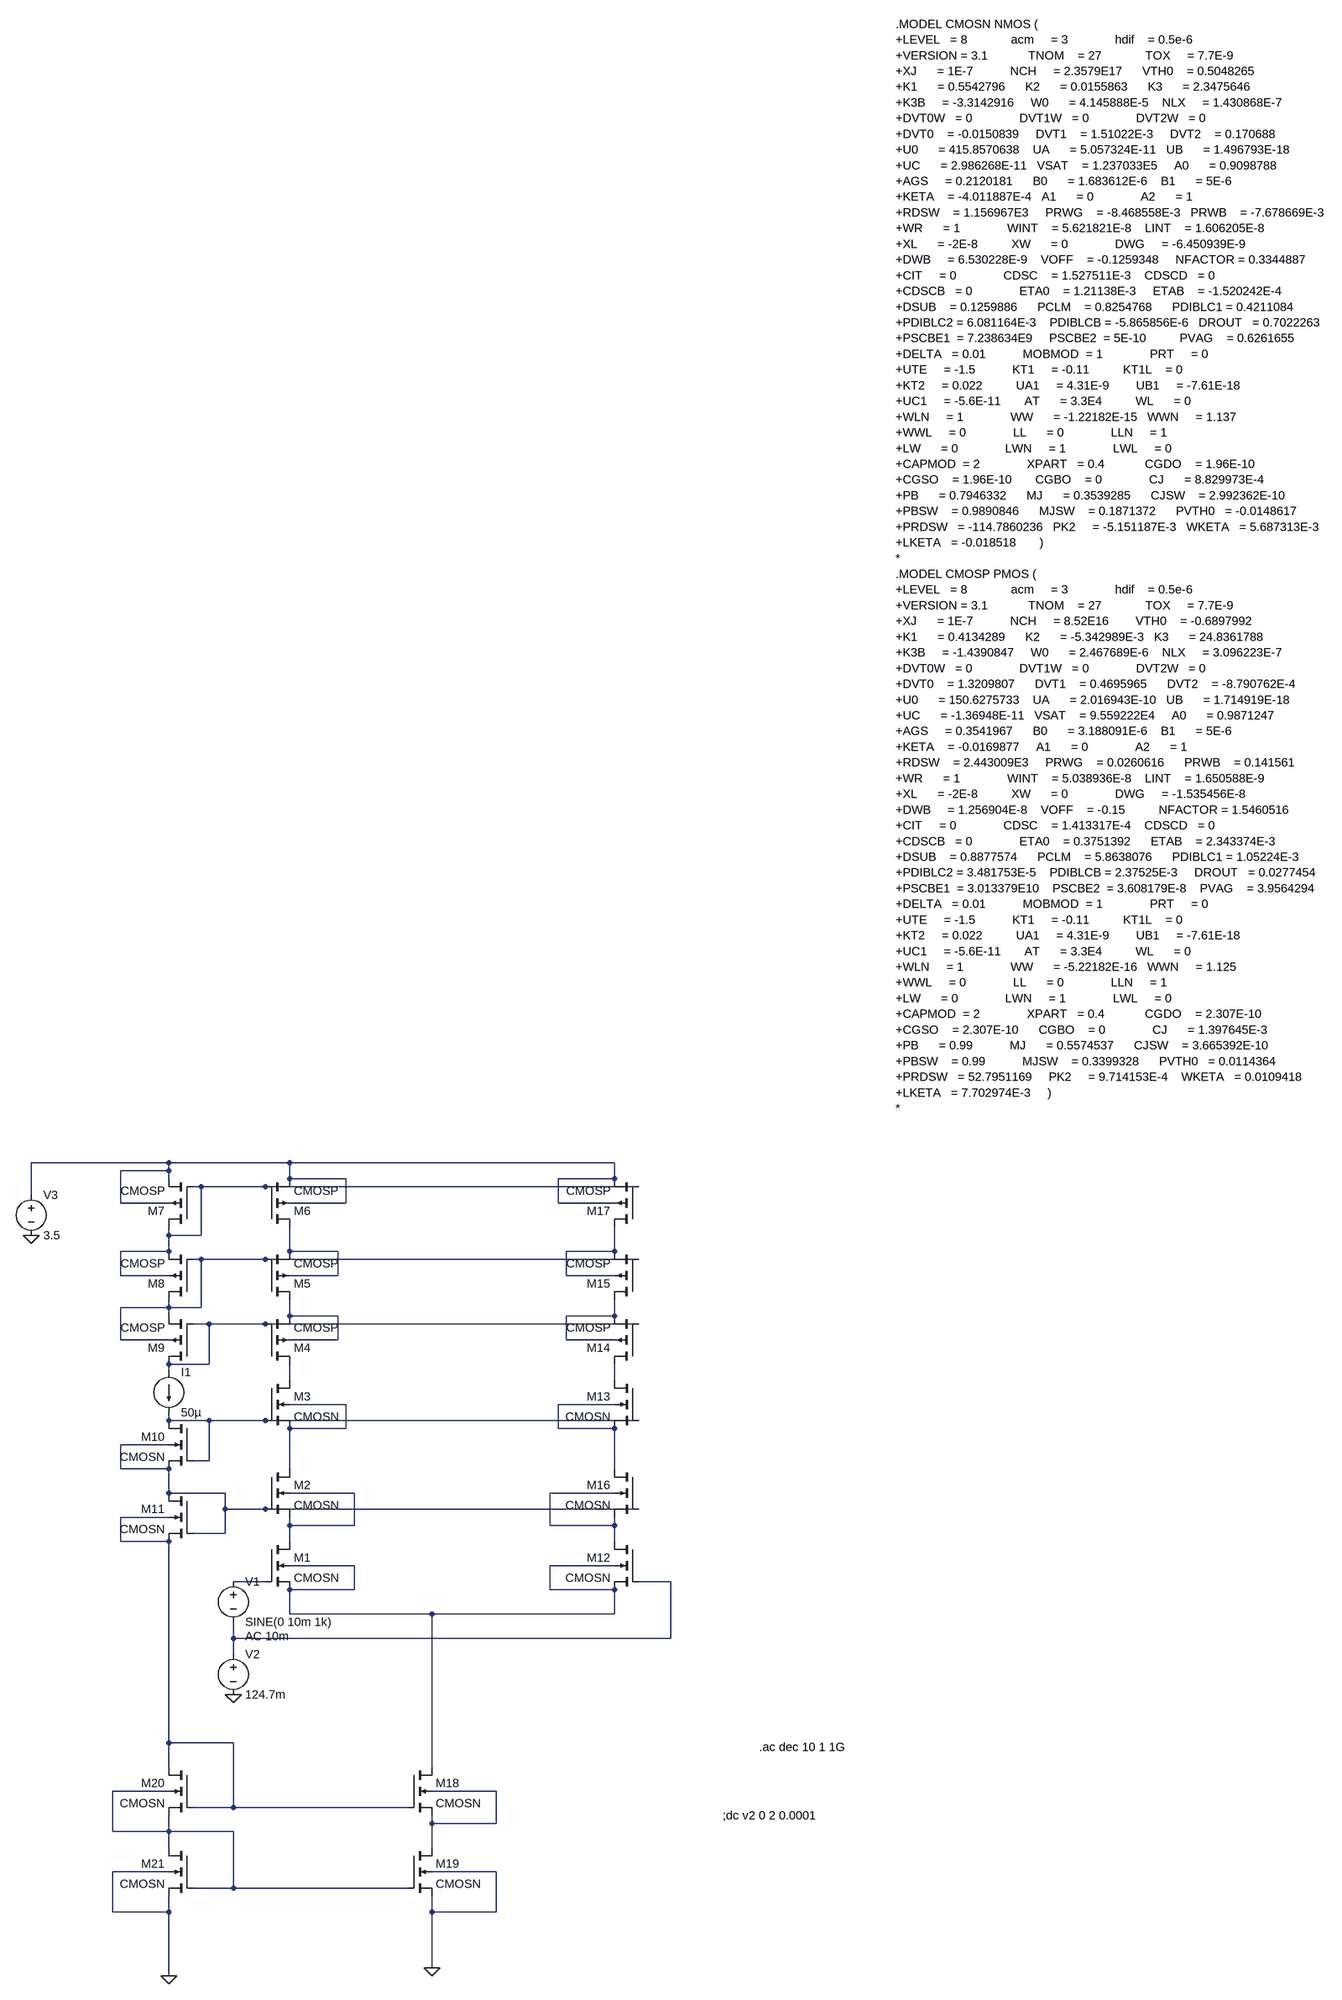
[diagram p0: schematic 92db.asc]
92db.asc, the LTspice schematic file:
Version 4
SHEET 1 3620 1788
WIRE -176 -496 -576 -496
WIRE 64 -496 -176 -496
WIRE 1024 -496 64 -496
WIRE -176 -480 -176 -496
WIRE -176 -480 -272 -480
WIRE -176 -464 -176 -480
WIRE 64 -464 64 -496
WIRE 176 -464 64 -464
WIRE 1024 -464 1024 -496
WIRE 1024 -464 912 -464
WIRE -112 -448 -128 -448
WIRE 16 -448 -112 -448
WIRE 1072 -448 16 -448
WIRE -576 -432 -576 -496
WIRE -272 -416 -272 -480
WIRE -176 -416 -272 -416
WIRE 176 -416 176 -464
WIRE 176 -416 64 -416
WIRE 912 -416 912 -464
WIRE 1024 -416 912 -416
WIRE -176 -352 -176 -368
WIRE -112 -352 -112 -448
WIRE -112 -352 -176 -352
WIRE -176 -320 -176 -352
WIRE -176 -320 -272 -320
WIRE 64 -320 64 -368
WIRE 160 -320 64 -320
WIRE 1024 -320 1024 -368
WIRE 1024 -320 928 -320
WIRE -112 -304 -128 -304
WIRE 16 -304 -112 -304
WIRE 1072 -304 16 -304
WIRE -272 -272 -272 -320
WIRE -176 -272 -272 -272
WIRE 160 -272 160 -320
WIRE 160 -272 64 -272
WIRE 928 -272 928 -320
WIRE 1024 -272 928 -272
WIRE -176 -208 -176 -224
WIRE -176 -208 -272 -208
WIRE -112 -208 -112 -304
WIRE -112 -208 -176 -208
WIRE -176 -192 -176 -208
WIRE 64 -192 64 -224
WIRE 160 -192 64 -192
WIRE 1024 -192 1024 -224
WIRE 1024 -192 928 -192
WIRE -96 -176 -128 -176
WIRE 16 -176 -96 -176
WIRE 1072 -176 16 -176
WIRE -272 -144 -272 -208
WIRE -176 -144 -272 -144
WIRE 160 -144 160 -192
WIRE 160 -144 64 -144
WIRE 928 -144 928 -192
WIRE 1024 -144 928 -144
WIRE -96 -96 -96 -176
WIRE -96 -96 -176 -96
WIRE -176 -80 -176 -96
WIRE 64 -64 64 -96
WIRE 1024 -64 1024 -96
WIRE 176 -16 64 -16
WIRE 1024 -16 912 -16
WIRE -176 16 -176 0
WIRE -96 16 -176 16
WIRE 16 16 -96 16
WIRE 1072 16 16 16
WIRE 176 32 176 -16
WIRE 176 32 64 32
WIRE 912 32 912 -16
WIRE 1024 32 912 32
WIRE -176 64 -272 64
WIRE -96 96 -96 16
WIRE -96 96 -128 96
WIRE -272 112 -272 64
WIRE -176 112 -272 112
WIRE 64 112 64 32
WIRE 1024 112 1024 32
WIRE -176 160 -176 112
WIRE -64 160 -176 160
WIRE 192 160 64 160
WIRE 1024 160 896 160
WIRE -64 192 -64 160
WIRE 16 192 -64 192
WIRE 1072 192 16 192
WIRE -176 208 -272 208
WIRE 64 224 64 208
WIRE 192 224 192 160
WIRE 192 224 64 224
WIRE 896 224 896 160
WIRE 1024 224 1024 208
WIRE 1024 224 896 224
WIRE -64 240 -64 192
WIRE -64 240 -128 240
WIRE -272 256 -272 208
WIRE -176 256 -272 256
WIRE 64 256 64 224
WIRE 1024 256 1024 224
WIRE 192 304 64 304
WIRE 1024 304 896 304
WIRE 16 336 -48 336
WIRE 1136 336 1072 336
WIRE 192 352 192 304
WIRE 192 352 64 352
WIRE 896 352 896 304
WIRE 1024 352 896 352
WIRE 64 400 64 352
WIRE 528 400 64 400
WIRE 1024 400 1024 352
WIRE 1024 400 528 400
WIRE -48 448 -48 416
WIRE 1136 448 1136 336
WIRE 1136 448 -48 448
WIRE -48 480 -48 448
WIRE -176 656 -176 256
WIRE -48 656 -176 656
WIRE -176 704 -176 656
WIRE 528 704 528 400
WIRE -176 752 -288 752
WIRE 656 752 528 752
WIRE -48 784 -48 656
WIRE -48 784 -128 784
WIRE 480 784 -48 784
WIRE 528 816 528 800
WIRE 656 816 656 752
WIRE 656 816 528 816
WIRE -288 832 -288 752
WIRE -176 832 -176 800
WIRE -176 832 -288 832
WIRE -48 832 -176 832
WIRE -176 864 -176 832
WIRE 528 864 528 816
WIRE -176 912 -288 912
WIRE 656 912 528 912
WIRE -48 944 -48 832
WIRE -48 944 -128 944
WIRE 480 944 -48 944
WIRE -288 992 -288 912
WIRE -176 992 -176 960
WIRE -176 992 -288 992
WIRE 528 992 528 960
WIRE 656 992 656 912
WIRE 656 992 528 992
WIRE 528 1104 528 992
WIRE -176 1120 -176 992
FLAG -48 560 0
FLAG -576 -352 0
FLAG -176 1120 0
FLAG 528 1104 0
SYMBOL nmos4 16 256 R0
SYMATTR InstName M1
SYMATTR Value CMOSN
SYMATTR Value2 l=0.8u w=399.0422985u
SYMBOL nmos4 16 -64 R0
SYMATTR InstName M3
SYMATTR Value CMOSN
SYMATTR Value2 l=0.8u w=3.832402235u
SYMBOL pmos4 16 -96 M180
SYMATTR InstName M4
SYMATTR Value CMOSP
SYMATTR Value2 l=0.8u w=0.08726248481u
SYMBOL pmos4 16 -224 M180
SYMATTR InstName M5
SYMATTR Value CMOSP
SYMATTR Value2 l=0.8u w=0.08726248481u
SYMBOL pmos4 -128 -224 R180
SYMATTR InstName M8
SYMATTR Value CMOSP
SYMATTR Value2 l=0.8u w=87.26248481u
SYMBOL pmos4 -128 -96 R180
SYMATTR InstName M9
SYMATTR Value CMOSP
SYMATTR Value2 l=0.8u w=87.26248481u
SYMBOL nmos4 -128 16 M0
SYMATTR InstName M10
SYMATTR Value CMOSN
SYMATTR Value2 l=0.8u w=3832.402235u
SYMBOL current -176 -80 R0
WINDOW 123 0 0 Left 0
WINDOW 39 0 0 Left 0
SYMATTR InstName I1
SYMATTR Value 50µ
SYMBOL voltage -48 320 R0
WINDOW 123 24 124 Left 2
WINDOW 39 0 0 Left 0
SYMATTR Value2 AC 10m
SYMATTR InstName V1
SYMATTR Value SINE(0 10m 1k)
SYMBOL voltage -48 464 R0
WINDOW 123 0 0 Left 0
WINDOW 39 0 0 Left 0
SYMATTR InstName V2
SYMATTR Value 124.7m
SYMBOL voltage -576 -448 R0
WINDOW 123 0 0 Left 0
WINDOW 39 0 0 Left 0
SYMATTR InstName V3
SYMATTR Value 3.5
SYMBOL nmos4 16 112 R0
SYMATTR InstName M2
SYMATTR Value CMOSN
SYMATTR Value2 l=0.8u w=3.832402235u
SYMBOL nmos4 -128 160 M0
SYMATTR InstName M11
SYMATTR Value CMOSN
SYMATTR Value2 l=0.8u w=977.5538809u
SYMBOL pmos4 -128 -368 R180
SYMATTR InstName M7
SYMATTR Value CMOSP
SYMATTR Value2 l=0.8u w=319.4316672u
SYMBOL pmos4 16 -368 M180
SYMATTR InstName M6
SYMATTR Value CMOSP
SYMATTR Value2 l=0.8u w=0.3194316672u
SYMBOL nmos4 1072 256 M0
SYMATTR InstName M12
SYMATTR Value CMOSN
SYMATTR Value2 l=0.8u w=399.0422985u
SYMBOL nmos4 1072 -64 M0
SYMATTR InstName M13
SYMATTR Value CMOSN
SYMATTR Value2 l=0.8u w=3.832402235u
SYMBOL pmos4 1072 -96 R180
SYMATTR InstName M14
SYMATTR Value CMOSP
SYMATTR Value2 l=0.8u w=0.08726248481u
SYMBOL pmos4 1072 -224 R180
SYMATTR InstName M15
SYMATTR Value CMOSP
SYMATTR Value2 l=0.8u w=0.08726248481u
SYMBOL nmos4 1072 112 M0
SYMATTR InstName M16
SYMATTR Value CMOSN
SYMATTR Value2 l=0.8u w=3.832402235u
SYMBOL pmos4 1072 -368 R180
SYMATTR InstName M17
SYMATTR Value CMOSP
SYMATTR Value2 l=0.8u w=0.3194316672u
SYMBOL nmos4 480 704 R0
SYMATTR InstName M18
SYMATTR Value CMOSN
SYMATTR Value2 l=0.8u w=3.547042653u
SYMBOL nmos4 480 864 R0
SYMATTR InstName M19
SYMATTR Value CMOSN
SYMATTR Value2 l=0.8u w=3.547042653u
SYMBOL nmos4 -128 704 M0
SYMATTR InstName M20
SYMATTR Value CMOSN
SYMATTR Value2 l=0.8u w=1773.521327u
SYMBOL nmos4 -128 864 M0
SYMATTR InstName M21
SYMATTR Value CMOSN
SYMATTR Value2 l=0.8u w=1773.521327u
TEXT 2712 -4752 Left 2 !.MODEL CMOSN NMOS (\n+LEVEL   = 8             acm     = 3              hdif    = 0.5e-6\n+VERSION = 3.1            TNOM    = 27             TOX     = 7.7E-9\n+XJ      = 1E-7           NCH     = 2.3579E17      VTH0    = 0.5048265\n+K1      = 0.5542796      K2      = 0.0155863      K3      = 2.3475646\n+K3B     = -3.3142916     W0      = 4.145888E-5    NLX     = 1.430868E-7\n+DVT0W   = 0              DVT1W   = 0              DVT2W   = 0\n+DVT0    = -0.0150839     DVT1    = 1.51022E-3     DVT2    = 0.170688\n+U0      = 415.8570638    UA      = 5.057324E-11   UB      = 1.496793E-18\n+UC      = 2.986268E-11   VSAT    = 1.237033E5     A0      = 0.9098788\n+AGS     = 0.2120181      B0      = 1.683612E-6    B1      = 5E-6\n+KETA    = -4.011887E-4   A1      = 0              A2      = 1\n+RDSW    = 1.156967E3     PRWG    = -8.468558E-3   PRWB    = -7.678669E-3\n+WR      = 1              WINT    = 5.621821E-8    LINT    = 1.606205E-8\n+XL      = -2E-8          XW      = 0              DWG     = -6.450939E-9\n+DWB     = 6.530228E-9    VOFF    = -0.1259348     NFACTOR = 0.3344887\n+CIT     = 0              CDSC    = 1.527511E-3    CDSCD   = 0\n+CDSCB   = 0              ETA0    = 1.21138E-3     ETAB    = -1.520242E-4\n+DSUB    = 0.1259886      PCLM    = 0.8254768      PDIBLC1 = 0.4211084\n+PDIBLC2 = 6.081164E-3    PDIBLCB = -5.865856E-6   DROUT   = 0.7022263\n+PSCBE1  = 7.238634E9     PSCBE2  = 5E-10          PVAG    = 0.6261655\n+DELTA   = 0.01           MOBMOD  = 1              PRT     = 0\n+UTE     = -1.5           KT1     = -0.11          KT1L    = 0\n+KT2     = 0.022          UA1     = 4.31E-9        UB1     = -7.61E-18\n+UC1     = -5.6E-11       AT      = 3.3E4          WL      = 0\n+WLN     = 1              WW      = -1.22182E-15   WWN     = 1.137\n+WWL     = 0              LL      = 0              LLN     = 1\n+LW      = 0              LWN     = 1              LWL     = 0\n+CAPMOD  = 2              XPART   = 0.4            CGDO    = 1.96E-10\n+CGSO    = 1.96E-10       CGBO    = 0              CJ      = 8.829973E-4\n+PB      = 0.7946332      MJ      = 0.3539285      CJSW    = 2.992362E-10\n+PBSW    = 0.9890846      MJSW    = 0.1871372      PVTH0   = -0.0148617\n+PRDSW   = -114.7860236   PK2     = -5.151187E-3   WKETA   = 5.687313E-3\n+LKETA   = -0.018518       )\n*\n.MODEL CMOSP PMOS (\n+LEVEL   = 8             acm     = 3              hdif    = 0.5e-6\n+VERSION = 3.1            TNOM    = 27             TOX     = 7.7E-9\n+XJ      = 1E-7           NCH     = 8.52E16        VTH0    = -0.6897992\n+K1      = 0.4134289      K2      = -5.342989E-3   K3      = 24.8361788\n+K3B     = -1.4390847     W0      = 2.467689E-6    NLX     = 3.096223E-7\n+DVT0W   = 0              DVT1W   = 0              DVT2W   = 0\n+DVT0    = 1.3209807      DVT1    = 0.4695965      DVT2    = -8.790762E-4\n+U0      = 150.6275733    UA      = 2.016943E-10   UB      = 1.714919E-18\n+UC      = -1.36948E-11   VSAT    = 9.559222E4     A0      = 0.9871247\n+AGS     = 0.3541967      B0      = 3.188091E-6    B1      = 5E-6\n+KETA    = -0.0169877     A1      = 0              A2      = 1\n+RDSW    = 2.443009E3     PRWG    = 0.0260616      PRWB    = 0.141561\n+WR      = 1              WINT    = 5.038936E-8    LINT    = 1.650588E-9\n+XL      = -2E-8          XW      = 0              DWG     = -1.535456E-8\n+DWB     = 1.256904E-8    VOFF    = -0.15          NFACTOR = 1.5460516\n+CIT     = 0              CDSC    = 1.413317E-4    CDSCD   = 0\n+CDSCB   = 0              ETA0    = 0.3751392      ETAB    = 2.343374E-3\n+DSUB    = 0.8877574      PCLM    = 5.8638076      PDIBLC1 = 1.05224E-3\n+PDIBLC2 = 3.481753E-5    PDIBLCB = 2.37525E-3     DROUT   = 0.0277454\n+PSCBE1  = 3.013379E10    PSCBE2  = 3.608179E-8    PVAG    = 3.9564294\n+DELTA   = 0.01           MOBMOD  = 1              PRT     = 0\n+UTE     = -1.5           KT1     = -0.11          KT1L    = 0\n+KT2     = 0.022          UA1     = 4.31E-9        UB1     = -7.61E-18\n+UC1     = -5.6E-11       AT      = 3.3E4          WL      = 0\n+WLN     = 1              WW      = -5.22182E-16   WWN     = 1.125\n+WWL     = 0              LL      = 0              LLN     = 1\n+LW      = 0              LWN     = 1              LWL     = 0\n+CAPMOD  = 2              XPART   = 0.4            CGDO    = 2.307E-10\n+CGSO    = 2.307E-10      CGBO    = 0              CJ      = 1.397645E-3\n+PB      = 0.99           MJ      = 0.5574537      CJSW    = 3.665392E-10\n+PBSW    = 0.99           MJSW    = 0.3399328      PVTH0   = 0.0114364\n+PRDSW   = 52.7951169     PK2     = 9.714153E-4    WKETA   = 0.0109418\n+LKETA   = 7.702974E-3     )\n*
TEXT 1256 800 Left 2 !;dc v2 0 2 0.0001
TEXT 1328 664 Left 2 !.ac dec 10 1 1G

The netlist it stands for:
* 92db.asc
M1 N015 N019 N018 N018 CMOSN l=0.8u w=399.0422985u
M3 N009 N013 N011 N011 CMOSN l=0.8u w=3.832402235u
M4 N009 N008 N006 N006 CMOSP l=0.8u w=0.08726248481u
M5 N006 N005 N003 N003 CMOSP l=0.8u w=0.08726248481u
M8 N005 N005 N002 N002 CMOSP l=0.8u w=87.26248481u
M9 N008 N008 N005 N005 CMOSP l=0.8u w=87.26248481u
M10 N013 N013 N014 N014 CMOSN l=0.8u w=3832.402235u
I1 N008 N013 50µ
V1 N019 N020 SINE(0 10m 1k) AC 10m
V2 N020 0 124.7m
V3 N001 0 3.5
M2 N011 N014 N015 N015 CMOSN l=0.8u w=3.832402235u
M11 N014 N014 N017 N017 CMOSN l=0.8u w=977.5538809u
M7 N002 N002 N001 N001 CMOSP l=0.8u w=319.4316672u
M6 N003 N002 N001 N001 CMOSP l=0.8u w=0.3194316672u
M12 N016 N020 N018 N018 CMOSN l=0.8u w=399.0422985u
M13 N010 N013 N012 N012 CMOSN l=0.8u w=3.832402235u
M14 N010 N008 N007 N007 CMOSP l=0.8u w=0.08726248481u
M15 N007 N005 N004 N004 CMOSP l=0.8u w=0.08726248481u
M16 N012 N014 N016 N016 CMOSN l=0.8u w=3.832402235u
M17 N004 N002 N001 N001 CMOSP l=0.8u w=0.3194316672u
M18 N018 N017 N022 N022 CMOSN l=0.8u w=3.547042653u
M19 N022 N021 0 0 CMOSN l=0.8u w=3.547042653u
M20 N017 N017 N021 N021 CMOSN l=0.8u w=1773.521327u
M21 N021 N021 0 0 CMOSN l=0.8u w=1773.521327u
.model NMOS NMOS
.model PMOS PMOS
.lib standard.mos
.MODEL CMOSN NMOS (
+LEVEL   = 8             acm     = 3              hdif    = 0.5e-6
+VERSION = 3.1            TNOM    = 27             TOX     = 7.7E-9
+XJ      = 1E-7           NCH     = 2.3579E17      VTH0    = 0.5048265
+K1      = 0.5542796      K2      = 0.0155863      K3      = 2.3475646
+K3B     = -3.3142916     W0      = 4.145888E-5    NLX     = 1.430868E-7
+DVT0W   = 0              DVT1W   = 0              DVT2W   = 0
+DVT0    = -0.0150839     DVT1    = 1.51022E-3     DVT2    = 0.170688
+U0      = 415.8570638    UA      = 5.057324E-11   UB      = 1.496793E-18
+UC      = 2.986268E-11   VSAT    = 1.237033E5     A0      = 0.9098788
+AGS     = 0.2120181      B0      = 1.683612E-6    B1      = 5E-6
+KETA    = -4.011887E-4   A1      = 0              A2      = 1
+RDSW    = 1.156967E3     PRWG    = -8.468558E-3   PRWB    = -7.678669E-3
+WR      = 1              WINT    = 5.621821E-8    LINT    = 1.606205E-8
+XL      = -2E-8          XW      = 0              DWG     = -6.450939E-9
+DWB     = 6.530228E-9    VOFF    = -0.1259348     NFACTOR = 0.3344887
+CIT     = 0              CDSC    = 1.527511E-3    CDSCD   = 0
+CDSCB   = 0              ETA0    = 1.21138E-3     ETAB    = -1.520242E-4
+DSUB    = 0.1259886      PCLM    = 0.8254768      PDIBLC1 = 0.4211084
+PDIBLC2 = 6.081164E-3    PDIBLCB = -5.865856E-6   DROUT   = 0.7022263
+PSCBE1  = 7.238634E9     PSCBE2  = 5E-10          PVAG    = 0.6261655
+DELTA   = 0.01           MOBMOD  = 1              PRT     = 0
+UTE     = -1.5           KT1     = -0.11          KT1L    = 0
+KT2     = 0.022          UA1     = 4.31E-9        UB1     = -7.61E-18
+UC1     = -5.6E-11       AT      = 3.3E4          WL      = 0
+WLN     = 1              WW      = -1.22182E-15   WWN     = 1.137
+WWL     = 0              LL      = 0              LLN     = 1
+LW      = 0              LWN     = 1              LWL     = 0
+CAPMOD  = 2              XPART   = 0.4            CGDO    = 1.96E-10
+CGSO    = 1.96E-10       CGBO    = 0              CJ      = 8.829973E-4
+PB      = 0.7946332      MJ      = 0.3539285      CJSW    = 2.992362E-10
+PBSW    = 0.9890846      MJSW    = 0.1871372      PVTH0   = -0.0148617
+PRDSW   = -114.7860236   PK2     = -5.151187E-3   WKETA   = 5.687313E-3
+LKETA   = -0.018518       )
*
.MODEL CMOSP PMOS (
+LEVEL   = 8             acm     = 3              hdif    = 0.5e-6
+VERSION = 3.1            TNOM    = 27             TOX     = 7.7E-9
+XJ      = 1E-7           NCH     = 8.52E16        VTH0    = -0.6897992
+K1      = 0.4134289      K2      = -5.342989E-3   K3      = 24.8361788
+K3B     = -1.4390847     W0      = 2.467689E-6    NLX     = 3.096223E-7
+DVT0W   = 0              DVT1W   = 0              DVT2W   = 0
+DVT0    = 1.3209807      DVT1    = 0.4695965      DVT2    = -8.790762E-4
+U0      = 150.6275733    UA      = 2.016943E-10   UB      = 1.714919E-18
+UC      = -1.36948E-11   VSAT    = 9.559222E4     A0      = 0.9871247
+AGS     = 0.3541967      B0      = 3.188091E-6    B1      = 5E-6
+KETA    = -0.0169877     A1      = 0              A2      = 1
+RDSW    = 2.443009E3     PRWG    = 0.0260616      PRWB    = 0.141561
+WR      = 1              WINT    = 5.038936E-8    LINT    = 1.650588E-9
+XL      = -2E-8          XW      = 0              DWG     = -1.535456E-8
+DWB     = 1.256904E-8    VOFF    = -0.15          NFACTOR = 1.5460516
+CIT     = 0              CDSC    = 1.413317E-4    CDSCD   = 0
+CDSCB   = 0              ETA0    = 0.3751392      ETAB    = 2.343374E-3
+DSUB    = 0.8877574      PCLM    = 5.8638076      PDIBLC1 = 1.05224E-3
+PDIBLC2 = 3.481753E-5    PDIBLCB = 2.37525E-3     DROUT   = 0.0277454
+PSCBE1  = 3.013379E10    PSCBE2  = 3.608179E-8    PVAG    = 3.9564294
+DELTA   = 0.01           MOBMOD  = 1              PRT     = 0
+UTE     = -1.5           KT1     = -0.11          KT1L    = 0
+KT2     = 0.022          UA1     = 4.31E-9        UB1     = -7.61E-18
+UC1     = -5.6E-11       AT      = 3.3E4          WL      = 0
+WLN     = 1              WW      = -5.22182E-16   WWN     = 1.125
+WWL     = 0              LL      = 0              LLN     = 1
+LW      = 0              LWN     = 1              LWL     = 0
+CAPMOD  = 2              XPART   = 0.4            CGDO    = 2.307E-10
+CGSO    = 2.307E-10      CGBO    = 0              CJ      = 1.397645E-3
+PB      = 0.99           MJ      = 0.5574537      CJSW    = 3.665392E-10
+PBSW    = 0.99           MJSW    = 0.3399328      PVTH0   = 0.0114364
+PRDSW   = 52.7951169     PK2     = 9.714153E-4    WKETA   = 0.0109418
+LKETA   = 7.702974E-3     )
*
;dc v2 0 2 0.0001
.ac dec 10 1 1G
.backanno
.end